# EAGLE design nix2-driver (EAGLE 5.00)
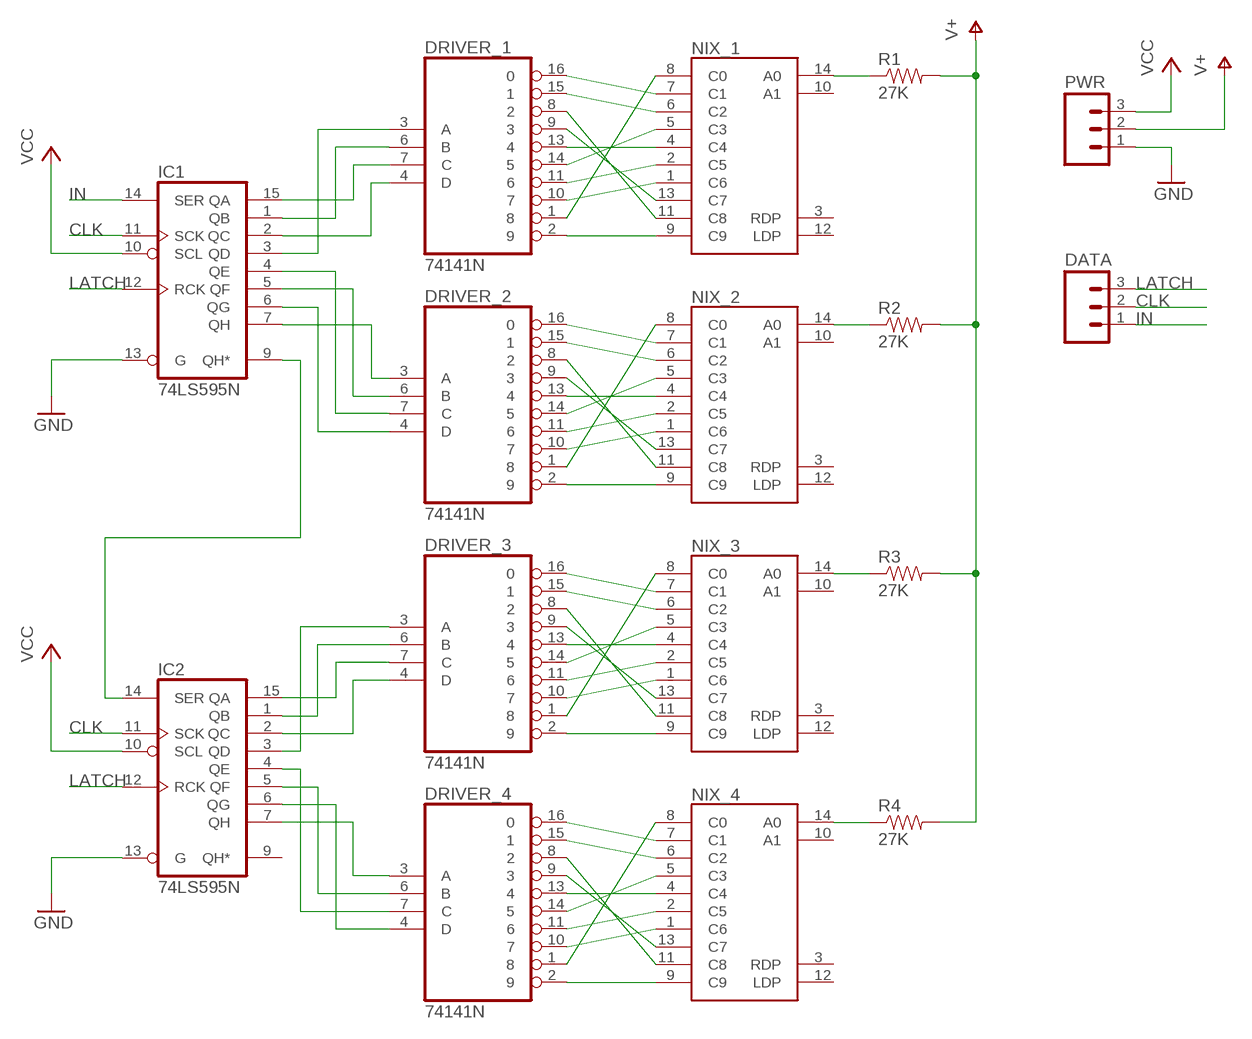
[diagram p0: schematic, sheet 1]

## Parts
DATA  M03PTH  [1X03]
DRIVER_1  74141N  [DIL16]
DRIVER_2  74141N  [DIL16]
DRIVER_3  74141N  [DIL16]
DRIVER_4  74141N  [DIL16]
IC1  74LS595N  [DIL16]
IC2  74LS595N  [DIL16]
NIX_1  B5870-SOCKET  [B5870-SOCKET]
NIX_2  B5870-SOCKET  [B5870-SOCKET]
NIX_3  B5870-SOCKET  [B5870-SOCKET]
NIX_4  B5870-SOCKET  [B5870-SOCKET]
PWR  M03PTH  [1X03]
R1  27K  RESISTORPTH1  [AXIAL-0.3]
R2  27K  RESISTORPTH1  [AXIAL-0.3]
R3  27K  RESISTORPTH1  [AXIAL-0.3]
R4  27K  RESISTORPTH1  [AXIAL-0.3]

## Nets
CLK: DATA.2 IC1.11(SCK) IC2.11(SCK)
GND: IC1.13(G) IC2.13(G) PWR.1
IN: DATA.1 IC1.14(SER)
LATCH: DATA.3 IC1.12(RCK) IC2.12(RCK)
N$1: DRIVER_1.2 NIX_1.9(C9)
N$2: DRIVER_1.1 NIX_1.8(C0)
N$3: DRIVER_1.10 NIX_1.1(C6)
N$4: DRIVER_1.11 NIX_1.2(C5)
N$5: DRIVER_1.14 NIX_1.5(C3)
N$6: DRIVER_1.13 NIX_1.4(C4)
N$7: DRIVER_1.9 NIX_1.13(C7)
N$8: DRIVER_1.8 NIX_1.11(C8)
N$9: DRIVER_1.15 NIX_1.6(C2)
N$10: DRIVER_1.16 NIX_1.7(C1)
N$11: DRIVER_2.2 NIX_2.9(C9)
N$12: DRIVER_2.1 NIX_2.8(C0)
N$13: DRIVER_2.10 NIX_2.1(C6)
N$14: DRIVER_2.11 NIX_2.2(C5)
N$15: DRIVER_2.14 NIX_2.5(C3)
N$16: DRIVER_2.13 NIX_2.4(C4)
N$17: DRIVER_2.9 NIX_2.13(C7)
N$18: DRIVER_2.8 NIX_2.11(C8)
N$19: DRIVER_2.15 NIX_2.6(C2)
N$20: DRIVER_2.16 NIX_2.7(C1)
N$21: DRIVER_3.16 NIX_3.7(C1)
N$22: DRIVER_3.15 NIX_3.6(C2)
N$23: DRIVER_3.8 NIX_3.11(C8)
N$24: DRIVER_3.9 NIX_3.13(C7)
N$25: DRIVER_3.13 NIX_3.4(C4)
N$26: DRIVER_3.14 NIX_3.5(C3)
N$27: DRIVER_3.11 NIX_3.2(C5)
N$28: DRIVER_3.10 NIX_3.1(C6)
N$29: DRIVER_3.1 NIX_3.8(C0)
N$30: DRIVER_3.2 NIX_3.9(C9)
N$31: DRIVER_4.16 NIX_4.7(C1)
N$32: DRIVER_4.15 NIX_4.6(C2)
N$33: DRIVER_4.8 NIX_4.11(C8)
N$34: DRIVER_4.9 NIX_4.13(C7)
N$35: DRIVER_4.13 NIX_4.4(C4)
N$36: DRIVER_4.14 NIX_4.5(C3)
N$37: DRIVER_4.11 NIX_4.2(C5)
N$38: DRIVER_4.10 NIX_4.1(C6)
N$39: DRIVER_4.1 NIX_4.8(C0)
N$40: DRIVER_4.2 NIX_4.9(C9)
N$41: DRIVER_1.4(D) IC1.2(QC)
N$42: DRIVER_3.3(A) IC2.3(QD)
N$43: DRIVER_1.6(B) IC1.1(QB)
N$44: DRIVER_1.3(A) IC1.3(QD)
N$45: DRIVER_2.3(A) IC1.7(QH)
N$46: DRIVER_2.6(B) IC1.5(QF)
N$47: DRIVER_2.7(C) IC1.4(QE)
N$48: DRIVER_2.4(D) IC1.6(QG)
N$49: DRIVER_3.6(B) IC2.1(QB)
N$50: DRIVER_3.7(C) IC2.15(QA)
N$51: DRIVER_3.4(D) IC2.2(QC)
N$52: DRIVER_4.7(C) IC2.4(QE)
N$53: DRIVER_4.6(B) IC2.5(QF)
N$54: DRIVER_4.4(D) IC2.6(QG)
N$55: DRIVER_4.3(A) IC2.7(QH)
N$56: IC1.9(QH*) IC2.14(SER)
N$57 [HV]: NIX_3.14(A0) R3.P$1
N$58 [HV]: NIX_4.14(A0) R4.P$1
N$60 [HV]: NIX_2.14(A0) R2.P$1
N$61 [HV]: NIX_1.14(A0) R1.P$1
N$62: DRIVER_1.7(C) IC1.15(QA)
V+ [HV]: PWR.2 R1.P$2 R2.P$2 R3.P$2 R4.P$2
VCC: IC1.10(SCL) IC2.10(SCL) PWR.3
Unconnected: IC2.9(QH*) NIX_1.3(RDP) NIX_1.10(A1) NIX_1.12(LDP) NIX_2.3(RDP) NIX_2.10(A1) NIX_2.12(LDP) NIX_3.3(RDP) NIX_3.10(A1) NIX_3.12(LDP) NIX_4.3(RDP) NIX_4.10(A1) NIX_4.12(LDP)

## Power pins joined to a net without a drawn wire
GND: DRIVER_1.12(GND) DRIVER_2.12(GND) DRIVER_3.12(GND) DRIVER_4.12(GND) IC1.8(GND) IC2.8(GND)
VCC: DRIVER_1.5(VCC) DRIVER_2.5(VCC) DRIVER_3.5(VCC) DRIVER_4.5(VCC) IC1.16(VCC) IC2.16(VCC)

## Library data of the parts
DATA PWR = SparkFun:M03: Header 3 Standard 3-pin 0.1" header. Use with straight break away headers (SKU : PRT-00116), right angle break away headers (PRT-00553), swiss pins (PRT-00743), machine pins (PRT-00117), and female headers (PRT-00115). Molex polarized connector foot print use with SKU : PRT-08232 with associated crimp pins and housings.
DRIVER_1-DRIVER_4 = 74xx-us:74*141: BCD to decimal DECODER/DRIVER
IC1 IC2 = 74xx-us:74*595: 8-bit SHIFT REGISTER, output latch
NIX_1-NIX_4 = ungood:B5870-SOCKET: Custom-made socket for Burroughs 5870 series Nixie tubes
R1-R4 = SparkFun:RESISTOR: Resistor Basic schematic elements and footprints for 0603, 1206, and PTH 1/10th watt (small) resistors.

## Net classes
1 HV: width 0.762 mm, clearance 0.508 mm

## Board
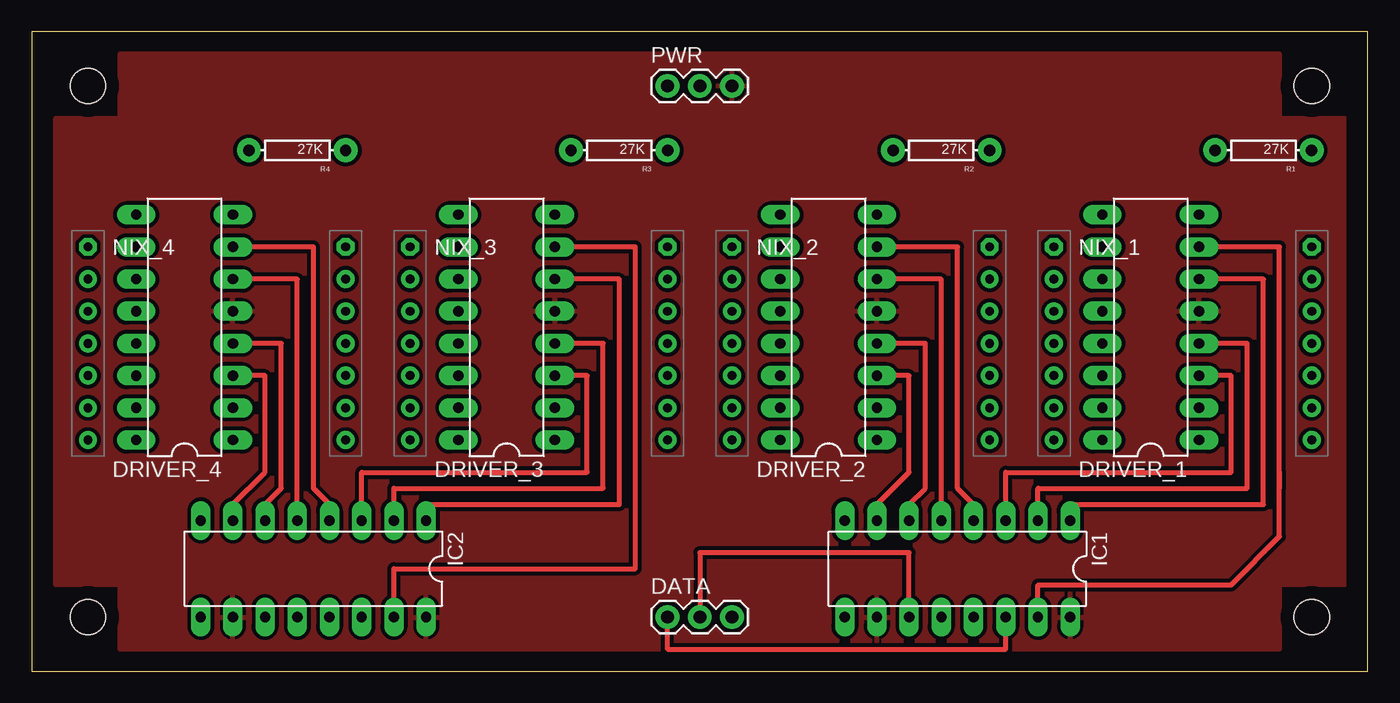
[diagram p1: board, top side]
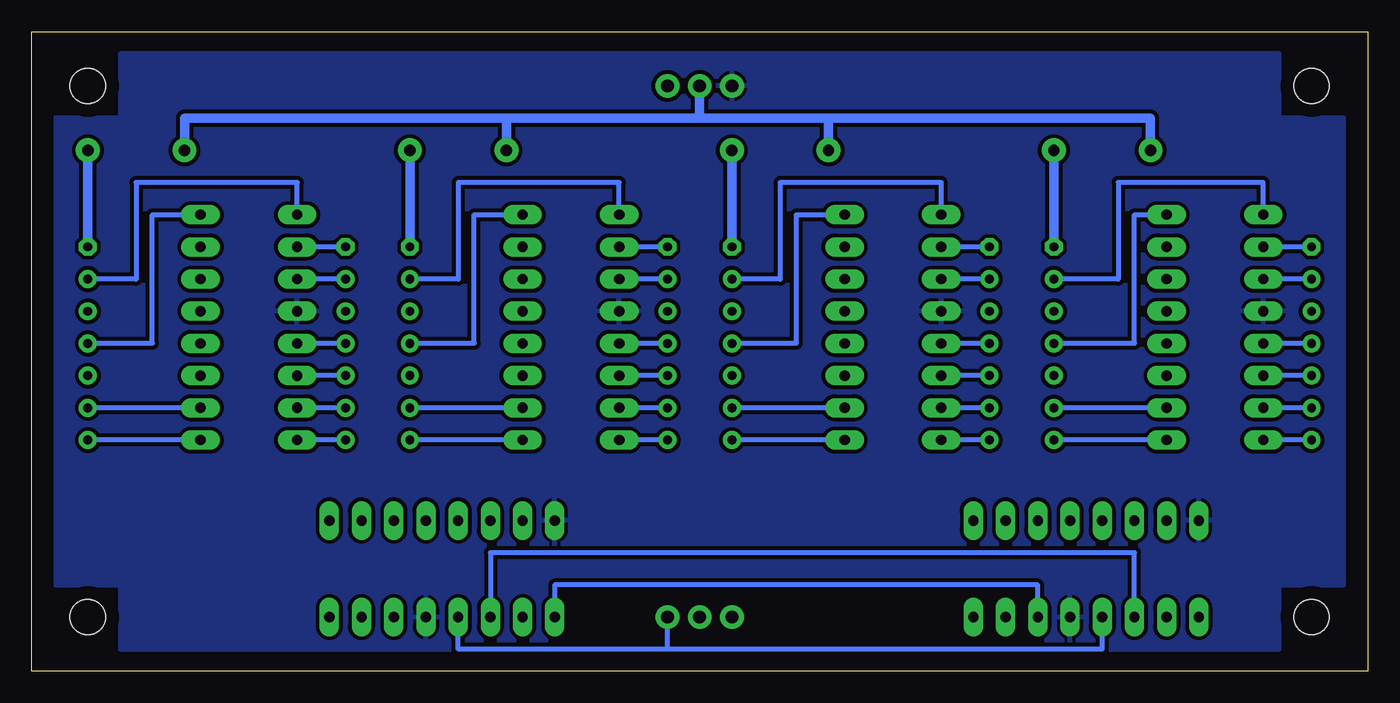
[diagram p2: board, bottom side, seen from below]

Size 105.39 x 50.47 mm. Coordinates in mm from the lower left corner, seen from the top.
Outline: 0,0 105.39,0 105.39,50.47 0,50.47 0,0
Copper layers (1*16): Top 0.035mm / dielectric 1.5mm / Bottom 0.035mm
Design rules "default *": minimum track width 10mil, minimum drill 16mil, track to track 10mil, track to pad 10mil, pad to pad 10mil, via to via 16mil, smd to smd 8mil, copper to edge 40mil, drill to drill 8mil, minimum pad ring 14mil, minimum via ring 8mil, stop-mask expansion 4mil, vias tented up to drill 0mil, thermal gap 10mil
Holes 2.8 mm at 4.44,46.19 100.96,46.19 100.96,4.28 4.44,4.28

### Footprints (pad centres in the part's own frame; a part is rotated, then mirrored left to right if it is on the bottom)
1X03 = drill 1.016 pad 1.88 round: 1 0,0; 2 2.54,0; 3 5.08,0
DIL16 = drill 0.813 long: 1 -8.89,-3.81; 2 -6.35,-3.81; 3 -3.81,-3.81; 4 -1.27,-3.81; 5 1.27,-3.81; 6 3.81,-3.81; 7 6.35,-3.81; 8 8.89,-3.81; 9 8.89,3.81; 10 6.35,3.81; 11 3.81,3.81; 12 1.27,3.81; 13 -1.27,3.81; 14 -3.81,3.81; 15 -6.35,3.81; 16 -8.89,3.81
B5870-SOCKET = drill 0.7 octagon: 1 -10.16,7.62; 14 10.16,7.62 | drill 0.7 round: 2 -10.16,5.08; 3 -10.16,2.54; 4 -10.16,0; 5 -10.16,-2.54; 6 -10.16,-5.08; 7 -10.16,-7.62; 8 10.16,-7.62; 9 10.16,-5.08; 10 10.16,-2.54; 11 10.16,0; 12 10.16,2.54; 13 10.16,5.08
AXIAL-0.3 = drill 0.9 pad 1.88 round: P$1 -3.81,0; P$2 3.81,0

### Placement (x,y rotation side)
DATA  50.16,4.28 0 top
DRIVER_1  88.26,27.14 90 top
DRIVER_2  62.86,27.14 90 top
DRIVER_3  37.46,27.14 90 top
DRIVER_4  12.06,27.14 90 top
IC1  73.02,8.09 180 top
IC2  22.22,8.09 180 top
NIX_1  90.8,25.87 0 top
NIX_2  65.4,25.87 0 top
NIX_3  40,25.87 0 top
NIX_4  14.6,25.87 0 top
PWR  50.16,46.19 0 top
R1  97.15,41.11 180 top
R2  71.75,41.11 180 top
R3  46.35,41.11 180 top
R4  20.95,41.11 180 top

### Tracks (layer width: path | path; a pad name or v marks a point on that pad's centre or on a via)
CLK
  Top 0.406: DATA.2 52.7,9.36 69.21,9.36 IC1.11
  Bottom 0.406: IC2.11 18.41,9.36 69.21,9.36 IC1.11
GND
  pour Bottom (isolate 0.305): 6.98,48.73 98.42,48.73 98.42,43.65 103.5,43.65 103.5,6.82 98.42,6.82 98.42,1.74 6.98,1.74 6.98,6.82 1.9,6.82 1.9,43.65 6.98,43.65
IN
  Top 0.406: DATA.1 50.16,1.74 76.83,1.74 IC1.14
LATCH
  Bottom 0.406: 55.24,1.74 71.75,1.74 IC1.12 | 55.24,1.74 DATA.3 | 55.24,1.74 20.95,1.74 IC2.12
N$1
  Bottom 0.406: DRIVER_1.2 NIX_1.9
N$2
  Bottom 0.406: DRIVER_1.1 NIX_1.8
N$3
  Bottom 0.406: NIX_1.1 DRIVER_1.10
N$4
  Bottom 0.406: NIX_1.2 DRIVER_1.11
N$5
  Bottom 0.406: NIX_1.5 DRIVER_1.14
N$6
  Bottom 0.406: NIX_1.4 DRIVER_1.13
N$7
  Bottom 0.406: NIX_1.13 97.15,30.95 97.15,38.57 84.45,38.57 DRIVER_1.9
N$8
  Bottom 0.406: DRIVER_1.8 95.88,36.03 95.88,25.87 NIX_1.11
N$9
  Bottom 0.406: NIX_1.6 DRIVER_1.15
N$10
  Bottom 0.406: NIX_1.7 DRIVER_1.16
N$11
  Bottom 0.406: DRIVER_2.2 NIX_2.9
N$12
  Bottom 0.406: DRIVER_2.1 NIX_2.8
N$13
  Bottom 0.406: NIX_2.1 DRIVER_2.10
N$14
  Bottom 0.406: NIX_2.2 DRIVER_2.11
N$15
  Bottom 0.406: NIX_2.5 DRIVER_2.14
N$16
  Bottom 0.406: NIX_2.4 DRIVER_2.13
N$17
  Bottom 0.406: DRIVER_2.9 59.05,38.57 71.75,38.57 71.75,30.95 NIX_2.13
N$18
  Bottom 0.406: DRIVER_2.8 70.48,36.03 70.48,25.87 NIX_2.11
N$19
  Bottom 0.406: NIX_2.6 DRIVER_2.15
N$20
  Bottom 0.406: NIX_2.7 DRIVER_2.16
N$21
  Bottom 0.406: NIX_3.7 DRIVER_3.16
N$22
  Bottom 0.406: NIX_3.6 DRIVER_3.15
N$23
  Bottom 0.406: DRIVER_3.8 45.08,36.03 45.08,25.87 NIX_3.11
N$24
  Bottom 0.406: DRIVER_3.9 33.65,38.57 46.35,38.57 46.35,30.95 NIX_3.13
N$25
  Bottom 0.406: NIX_3.4 DRIVER_3.13
N$26
  Bottom 0.406: NIX_3.5 DRIVER_3.14
N$27
  Bottom 0.406: NIX_3.2 DRIVER_3.11
N$28
  Bottom 0.406: NIX_3.1 DRIVER_3.10
N$29
  Bottom 0.406: DRIVER_3.1 NIX_3.8
N$30
  Bottom 0.406: DRIVER_3.2 NIX_3.9
N$31
  Bottom 0.406: NIX_4.7 DRIVER_4.16
N$32
  Bottom 0.406: NIX_4.6 DRIVER_4.15
N$33
  Bottom 0.406: DRIVER_4.8 18.41,36.03 18.41,25.87 NIX_4.11
N$34
  Bottom 0.406: DRIVER_4.9 8.25,38.57 19.68,38.57 19.68,30.95 NIX_4.13
N$35
  Bottom 0.406: NIX_4.4 DRIVER_4.13
N$36
  Bottom 0.406: NIX_4.5 DRIVER_4.14
N$37
  Bottom 0.406: NIX_4.2 DRIVER_4.11
N$38
  Bottom 0.406: NIX_4.1 DRIVER_4.10
N$39
  Bottom 0.406: DRIVER_4.1 NIX_4.8
N$40
  Bottom 0.406: DRIVER_4.2 NIX_4.9
N$41
  Top 0.406: IC1.2 79.37,14.44 95.88,14.44 95.88,25.87 DRIVER_1.4
N$42
  Top 0.406: DRIVER_3.3 43.81,23.33 43.81,15.71 26.03,15.71 IC2.3
N$43
  Top 0.406: DRIVER_1.6 97.15,30.95 97.15,13.17 81.91,13.17 IC1.1
N$44
  Top 0.406: DRIVER_1.3 94.61,23.33 94.61,15.71 76.83,15.71 IC1.3
N$45
  Top 0.406: DRIVER_2.3 69.21,23.33 69.21,15.71 66.67,13.17 IC1.7
N$46
  Top 0.406: DRIVER_2.6 71.75,30.95 IC1.5
N$47
  Top 0.406: DRIVER_2.7 73.02,33.49 73.02,14.44 74.29,13.17 IC1.4
N$48
  Top 0.406: DRIVER_2.4 70.48,25.87 70.48,14.44 69.21,13.17 IC1.6
N$49
  Top 0.406: DRIVER_3.6 46.35,30.95 46.35,13.17 31.11,13.17 IC2.1
N$50
  Top 0.406: IC2.15 28.57,8.09 47.62,8.09 47.62,33.49 DRIVER_3.7
N$51
  Top 0.406: IC2.2 28.57,14.44 45.08,14.44 45.08,25.87 DRIVER_3.4
N$52
  Top 0.406: DRIVER_4.7 22.22,33.49 22.22,14.44 23.49,13.17 IC2.4
N$53
  Top 0.406: DRIVER_4.6 20.95,30.95 IC2.5
N$54
  Top 0.406: DRIVER_4.4 19.68,25.87 19.68,14.44 18.41,13.17 IC2.6
N$55
  Top 0.406: DRIVER_4.3 18.41,23.33 18.41,15.71 15.87,13.17 IC2.7
N$56
  Bottom 0.406: IC2.14 26.03,6.82 64.13,6.82 IC1.9
N$57
  Bottom 0.762: NIX_3.14 R3.P$1
N$58
  Bottom 0.762: NIX_4.14 R4.P$1
N$60
  Bottom 0.762: NIX_2.14 R2.P$1
N$61
  Bottom 0.762: NIX_1.14 R1.P$1
N$62
  Top 0.406: DRIVER_1.7 98.42,33.49 98.42,15.71 | 98.42,15.71 98.42,14.44 | IC1.15 79.37,6.82 94.61,6.82 98.42,10.63 98.42,15.71
V+
  Bottom 0.762: R4.P$2 17.14,43.65 42.54,43.65 | 67.94,43.65 93.34,43.65 R1.P$2 | 42.54,43.65 R3.P$2 | 42.54,43.65 52.7,43.65 | 52.7,43.65 67.94,43.65 | 67.94,43.65 R2.P$2 | 52.7,43.65 PWR.2
VCC
  pour Top (isolate 0.305): 1.9,43.65 6.98,43.65 6.98,48.73 98.42,48.73 98.42,43.65 103.5,43.65 103.5,6.82 98.42,6.82 98.42,1.74 6.98,1.74 6.98,6.82 1.9,6.82